# Altium schematic sheet MB1297_MEMS.SchDoc: MEMS Sensors
size A4; DocumentNumber: MB1297; Revision: D; SheetNumber: 6; SheetTotal: 11
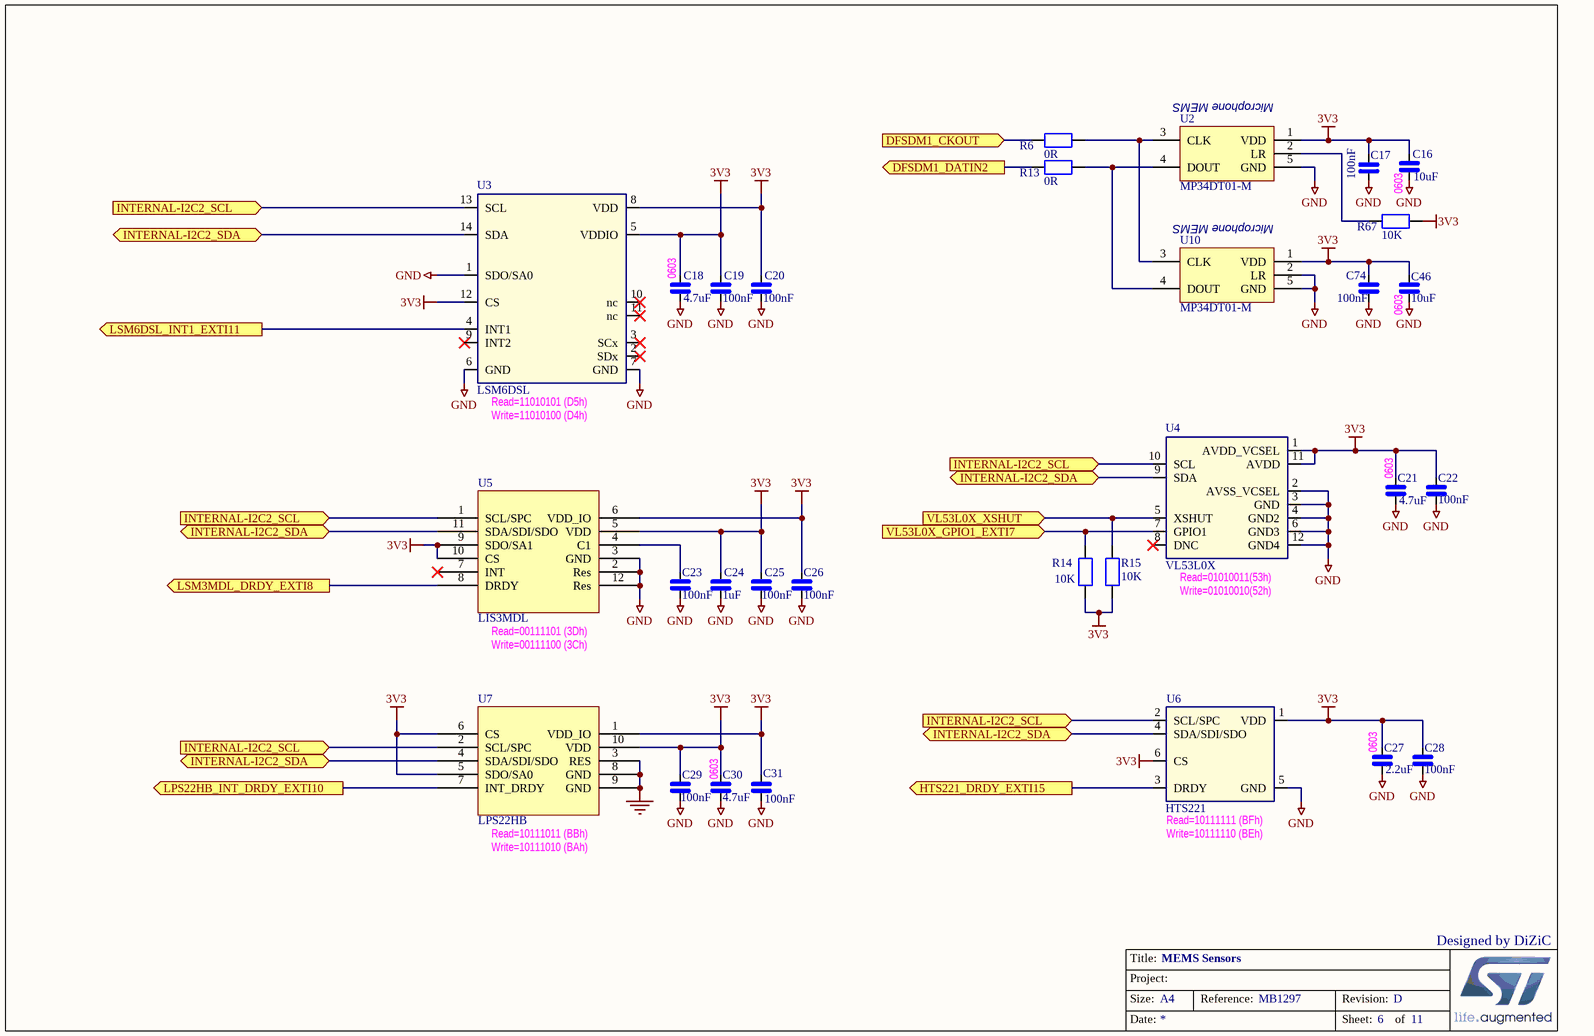
[diagram p0: MB1297_MEMS.SchDoc]

## Parts
C16  10uF  [0603_CAP_NPOL]
C17  100nF  [0402_CAP_NPOL]
C18  4.7uF  [0603_CAP_NPOL]
C19  100nF  [0402_CAP_NPOL]
C20  100nF  [0402_CAP_NPOL]
C21  4.7uF  [0603_CAP_NPOL]
C22  100nF  [0402_CAP_NPOL]
C23  100nF  [0402_CAP_NPOL]
C24  1uF  [0402_CAP_NPOL]
C25  100nF  [0402_CAP_NPOL]
C26  100nF  [0402_CAP_NPOL]
C27  2.2uF  [0603_CAP_NPOL]
C28  100nF  [0402_CAP_NPOL]
C29  100nF  [0402_CAP_NPOL]
C30  4.7uF  [0603_CAP_NPOL]
C31  100nF  [0402_CAP_NPOL]
C46  10uF  [0603_CAP_NPOL]
C74  100nF  [0402_CAP_NPOL]
R6  0R  [0402_RES]
R13  0R  [0402_RES]
R14  10K  [0402_RES]
R15  10K  [0402_RES]
R67  10K  [0402_RES]
U2  MP34DT01-M  [HCLGA-4LD 3x4x1]
U3  LSM6DSL  [LGA14L-2.5X3X0.86p0.5]
U4  VL53L0X  [LGA12-optical]
U5  LIS3MDL  [VFLGA12-2x2x1]
U6  HTS221  [HLGA6L-2x2x0.9]
U7  LPS22HB  [HLGA10L-2X2X0.76]
U10  MP34DT01-M  [HCLGA-4LD 3x4x1]

## Ports
DFSDM1_CKOUT, DFSDM1_DATIN2, HTS221_DRDY_EXTI15, INTERNAL-I2C2_SCL, INTERNAL-I2C2_SDA, LPS22HB_INT_DRDY_EXTI10, LSM3MDL_DRDY_EXTI8, LSM6DSL_INT1_EXTI11, VL53L0X_GPIO1_EXTI7, VL53L0X_XSHUT

## Nets
3V3: C16.1 C17.2 C18.1 C19.1 C20.1 C21.1 C22.1 C24.1 C25.1 C26.1 C27.1 C28.1 C29.1 C30.1 C31.1 C46.1 C74.1 R14.1 R15.1 R67.1 U2.1(VDD) U3.5(VDDIO) U3.8(VDD) U3.12(CS) U4.1(AVDD_VCSEL) U4.11(AVDD) U5.5(VDD) U5.6(VDD_IO) U5.9(SDO/SA1) U5.10(CS) U6.1(VDD) U6.6(CS) U7.1(VDD_IO) U7.5(SDO/SA0) U7.6(CS) U7.10(VDD) U10.1(VDD)
GND: C16.2 C17.1 C18.2 C19.2 C20.2 C21.2 C22.2 C23.2 C24.2 C25.2 C26.2 C27.2 C28.2 C29.2 C30.2 C31.2 C46.2 C74.2 U2.5(GND) U3.1(SDO/SA0) U3.6(GND) U3.7(GND) U4.2(AVSS_VCSEL) U4.3(GND) U4.4(GND2) U4.6(GND3) U4.12(GND4) U5.2(Res) U5.3(GND) U5.12(Res) U6.5(GND) U7.3(RES) U7.8(GND) U7.9(GND) U10.2(LR) U10.5(GND)
DFSDM1_CKOUT: R6.2 ; port DFSDM1_CKOUT
DFSDM1_DATIN2: R13.2 ; port DFSDM1_DATIN2
HTS221_DRDY_EXTI15: U6.3(DRDY) ; port HTS221_DRDY_EXTI15
INTERNAL-I2C2_SCL: U3.13(SCL) U4.10(SCL) U5.1(SCL/SPC) U6.2(SCL/SPC) U7.2(SCL/SPC) ; port INTERNAL-I2C2_SCL
INTERNAL-I2C2_SDA: U3.14(SDA) U4.9(SDA) U5.11(SDA/SDI/SDO) U6.4(SDA/SDI/SDO) U7.4(SDA/SDI/SDO) ; port INTERNAL-I2C2_SDA
LPS22HB_INT_DRDY_EXTI10: U7.7(INT_DRDY) ; port LPS22HB_INT_DRDY_EXTI10
LSM3MDL_DRDY_EXTI8: U5.8(DRDY) ; port LSM3MDL_DRDY_EXTI8
LSM6DSL_INT1_EXTI11: U3.4(INT1) ; port LSM6DSL_INT1_EXTI11
VL53L0X_GPIO1_EXTI7: R14.2 U4.7(GPIO1) ; port VL53L0X_GPIO1_EXTI7
VL53L0X_XSHUT: R15.2 U4.5(XSHUT) ; port VL53L0X_XSHUT
NetC23_1: C23.1 U5.4(C1)
NetR6_1: R6.1 U2.3(CLK) U10.3(CLK)
NetR13_1: R13.1 U2.4(DOUT) U10.4(DOUT)
NetR67_2: R67.2 U2.2(LR)

Not connected (* = marked no-connect by the designer): U3 2(SDx)* 3(SCx)* 9(INT2)* 10(nc)* 11(nc)*; U4 8(DNC)*; U5 7(INT)*

## Notes on the sheet
- (near U2) Microphone MEMS
- (near U10) Microphone MEMS
- (near C16) 0603
- (near C18) 0603
- (near C46) 0603
- (near U3) Read=11010101 (D5h)
- (near U3) Write=11010100 (D4h)
- (near C21) 0603
- (near U4) Read=01010011(53h)
- (near U5) Read=00111101 (3Dh)
- Write=00111100 (3Ch)
- (near U4) Write=01010010(52h)
- (near C30) 0603
- (near C27) 0603
- (near U7) Read=10111011 (BBh)
- Write=10111010 (BAh)
- (near U6) Read=10111111 (BFh)
- (near U6) Write=10111110 (BEh)
- Designed by DiZiC
- Title:
- Project:
- Size:
- Date:
- A4
- Reference:
- Sheet:
- Revision:
- of

## Library data of the parts
C16-C31 C46 C74 = CAP_NPOL: Capacitor_not polarized
R6 R13-R15 R67 = RES: Resistor
U2 U10 = MP34DT01: MEMS audio microphone
U3 = LSM6DSL: Accelero + Gyro MEMS (6 Axis)
U4 = VL53L0X: Proximity sensor MEMS
U5 = LIS3MDL: IC,Sensor; Provider: MMCC; Vendor: ST; AsmInst: *; Category: IC; PartNumber: *
U6 = HTS221: Humidity + Temp MEMS
U7 = LPS22HB: IC,Sensor; Provider: MMCC; Vendor: ST; AsmInst: *; Category: IC; PartNumber: *